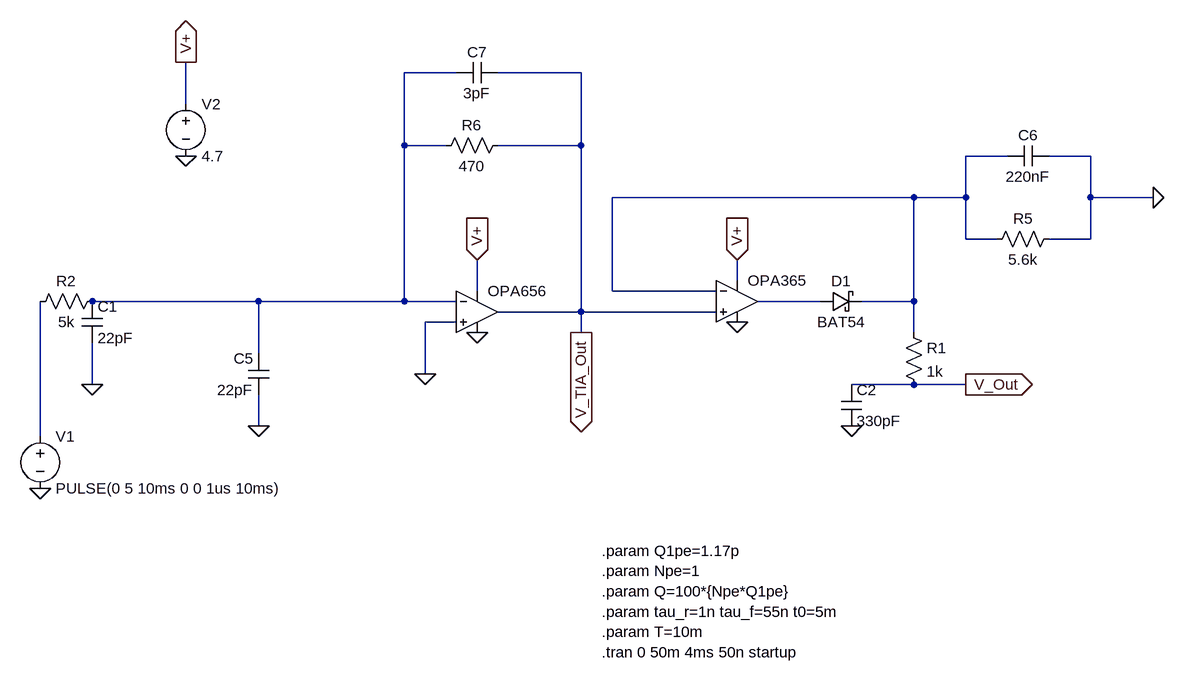
[diagram p0: schematic AFE_Sim.asc]
AFE_Sim.asc, the LTspice schematic file:
Version 4.1
SHEET 1 4992 1212
WIRE 1936 -112 1856 -112
WIRE 2128 -112 2000 -112
WIRE 1520 -64 1520 -128
WIRE 1856 0 1856 -112
WIRE 1920 0 1856 0
WIRE 2128 0 2128 -112
WIRE 2128 0 2000 0
WIRE 2784 16 2720 16
WIRE 2912 16 2848 16
WIRE 2640 80 2176 80
WIRE 2720 80 2720 16
WIRE 2720 80 2640 80
WIRE 2912 80 2912 16
WIRE 3008 80 2912 80
WIRE 2720 144 2720 80
WIRE 2768 144 2720 144
WIRE 2912 144 2912 80
WIRE 2912 144 2848 144
WIRE 2368 208 2368 176
WIRE 1968 224 1968 176
WIRE 2176 224 2176 80
WIRE 2336 224 2176 224
WIRE 1632 240 1376 240
WIRE 1856 240 1856 0
WIRE 1856 240 1632 240
WIRE 1936 240 1856 240
WIRE 2496 240 2400 240
WIRE 2640 240 2640 80
WIRE 2640 240 2560 240
WIRE 2128 256 2128 0
WIRE 2128 256 2000 256
WIRE 2336 256 2128 256
WIRE 1936 272 1888 272
WIRE 2128 288 2128 256
WIRE 2640 288 2640 240
WIRE 1632 320 1632 240
WIRE 1888 352 1888 272
WIRE 1376 368 1376 304
WIRE 2640 368 2544 368
WIRE 2720 368 2640 368
WIRE 1632 432 1632 384
WIRE 1296 448 1296 240
FLAG 1520 16 0
FLAG 1520 -128 V+
IOPIN 1520 -128 Out
FLAG 1968 176 V+
IOPIN 1968 176 In
FLAG 2368 176 V+
IOPIN 2368 176 In
FLAG 1296 528 0
FLAG 1376 368 0
FLAG 2544 432 0
FLAG 2720 368 V_Out
IOPIN 2720 368 Out
FLAG 1632 432 0
FLAG 1888 352 0
FLAG 3008 80 0
FLAG 1968 288 0
FLAG 2368 272 0
FLAG 2128 288 V_TIA_Out
IOPIN 2128 288 Out
SYMBOL OpAmps\\UniversalOpAmp2 1968 256 R0
SYMATTR InstName OPA656
SYMATTR Value2 Avol=1e5 GBW=230Meg Slew=290Meg
SYMATTR SpiceLine Ilimit=30m Rail=0 Vos=0
SYMATTR SpiceLine2 En=0 Enk=0 In=0 Ink=0 Rin=100Meg
SYMBOL OpAmps\\UniversalOpAmp2 2368 240 R0
SYMATTR InstName OPA365
SYMATTR Value2 Avol=1e5 GBW=50Meg Slew=25Meg
SYMATTR SpiceLine Ilimit=30m Rail=0 Vos=0.2m
SYMATTR SpiceLine2 En=0 Enk=0 In=0 Ink=0 Rin=100Meg
SYMBOL cap 1648 384 R180
WINDOW 0 24 56 Left 2
WINDOW 3 24 8 Left 2
SYMATTR InstName C5
SYMATTR Value 22pF
SYMBOL schottky 2496 256 R270
WINDOW 0 32 32 VTop 2
WINDOW 3 0 32 VBottom 2
SYMATTR InstName D1
SYMATTR Value BAT54
SYMBOL cap 2848 0 R90
WINDOW 0 0 32 VBottom 2
WINDOW 3 32 32 VTop 2
SYMATTR InstName C6
SYMATTR Value 220nF
SYMBOL res 2864 128 R90
WINDOW 0 0 56 VBottom 2
WINDOW 3 32 56 VTop 2
SYMATTR InstName R5
SYMATTR Value 5.6k
SYMBOL res 2016 -16 R90
WINDOW 0 0 56 VBottom 2
WINDOW 3 32 56 VTop 2
SYMATTR InstName R6
SYMATTR Value 470
SYMBOL cap 2000 -128 R90
WINDOW 0 0 32 VBottom 2
WINDOW 3 32 32 VTop 2
SYMATTR InstName C7
SYMATTR Value 3pF
SYMBOL voltage 1520 -80 R0
WINDOW 123 0 0 Left 0
WINDOW 39 0 0 Left 0
SYMATTR InstName V2
SYMATTR Value 4.7
SYMBOL voltage 1296 432 R0
WINDOW 123 0 0 Left 0
WINDOW 39 0 0 Left 0
SYMATTR InstName V1
SYMATTR Value PULSE(0 5 10ms 0 0 1us 10ms)
SYMBOL res 2624 272 R0
SYMATTR InstName R1
SYMATTR Value 1k
SYMBOL cap 2528 368 R0
SYMATTR InstName C2
SYMATTR Value 330pF
SYMBOL res 1392 224 R90
WINDOW 0 0 56 VBottom 2
WINDOW 3 32 56 VTop 2
SYMATTR InstName R2
SYMATTR Value 5k
SYMBOL cap 1360 240 R0
SYMATTR InstName C1
SYMATTR Value 22pF
TEXT 2160 624 Left 2 !.param Q1pe=1.17p\n.param Npe=1\n.param Q=100*{Npe*Q1pe}\n.param tau_r=1n tau_f=55n t0=5m\n.param T=10m\n.tran 0 50m 4ms 50n startup

The netlist it stands for:
* AFE_Sim.asc
X§OPA656 0 N001 V+ 0 V_TIA_Out level2 Avol=1e5 GBW=230Meg Slew=290Meg Ilimit=30m Rail=0 Vos=0 En=0 Enk=0 In=0 Ink=0 Rin=100Meg  ; pins In+ In- V+ V- OUT
X§OPA365 V_TIA_Out N002 V+ 0 N003 level2 Avol=1e5 GBW=50Meg Slew=25Meg Ilimit=30m Rail=0 Vos=0.2m En=0 Enk=0 In=0 Ink=0 Rin=100Meg  ; pins In+ In- V+ V- OUT
C5 0 N001 22pF
D1 N003 N002 BAT54
C6 0 N002 220nF
R5 0 N002 5.6k
R6 V_TIA_Out N001 470
C7 V_TIA_Out N001 3pF
V2 V+ 0 4.7
V1 N004 0 PULSE(0 5 10ms 0 0 1us 10ms)
R1 N002 V_Out 1k
C2 V_Out 0 330pF
R2 N001 N004 5k
C1 N001 0 22pF
.model D D
.lib standard.dio
.param Q1pe=1.17p
.param Npe=1
.param Q=100*{Npe*Q1pe}
.param tau_r=1n tau_f=55n t0=5m
.param T=10m
.tran 0 50m 4ms 50n startup
.lib UniversalOpAmp2.lib
.backanno
.end